# Altium schematic sheet HD3SS460-PORT 1.SchDoc
size A3; SheetNumber: 2; SheetTotal: 9
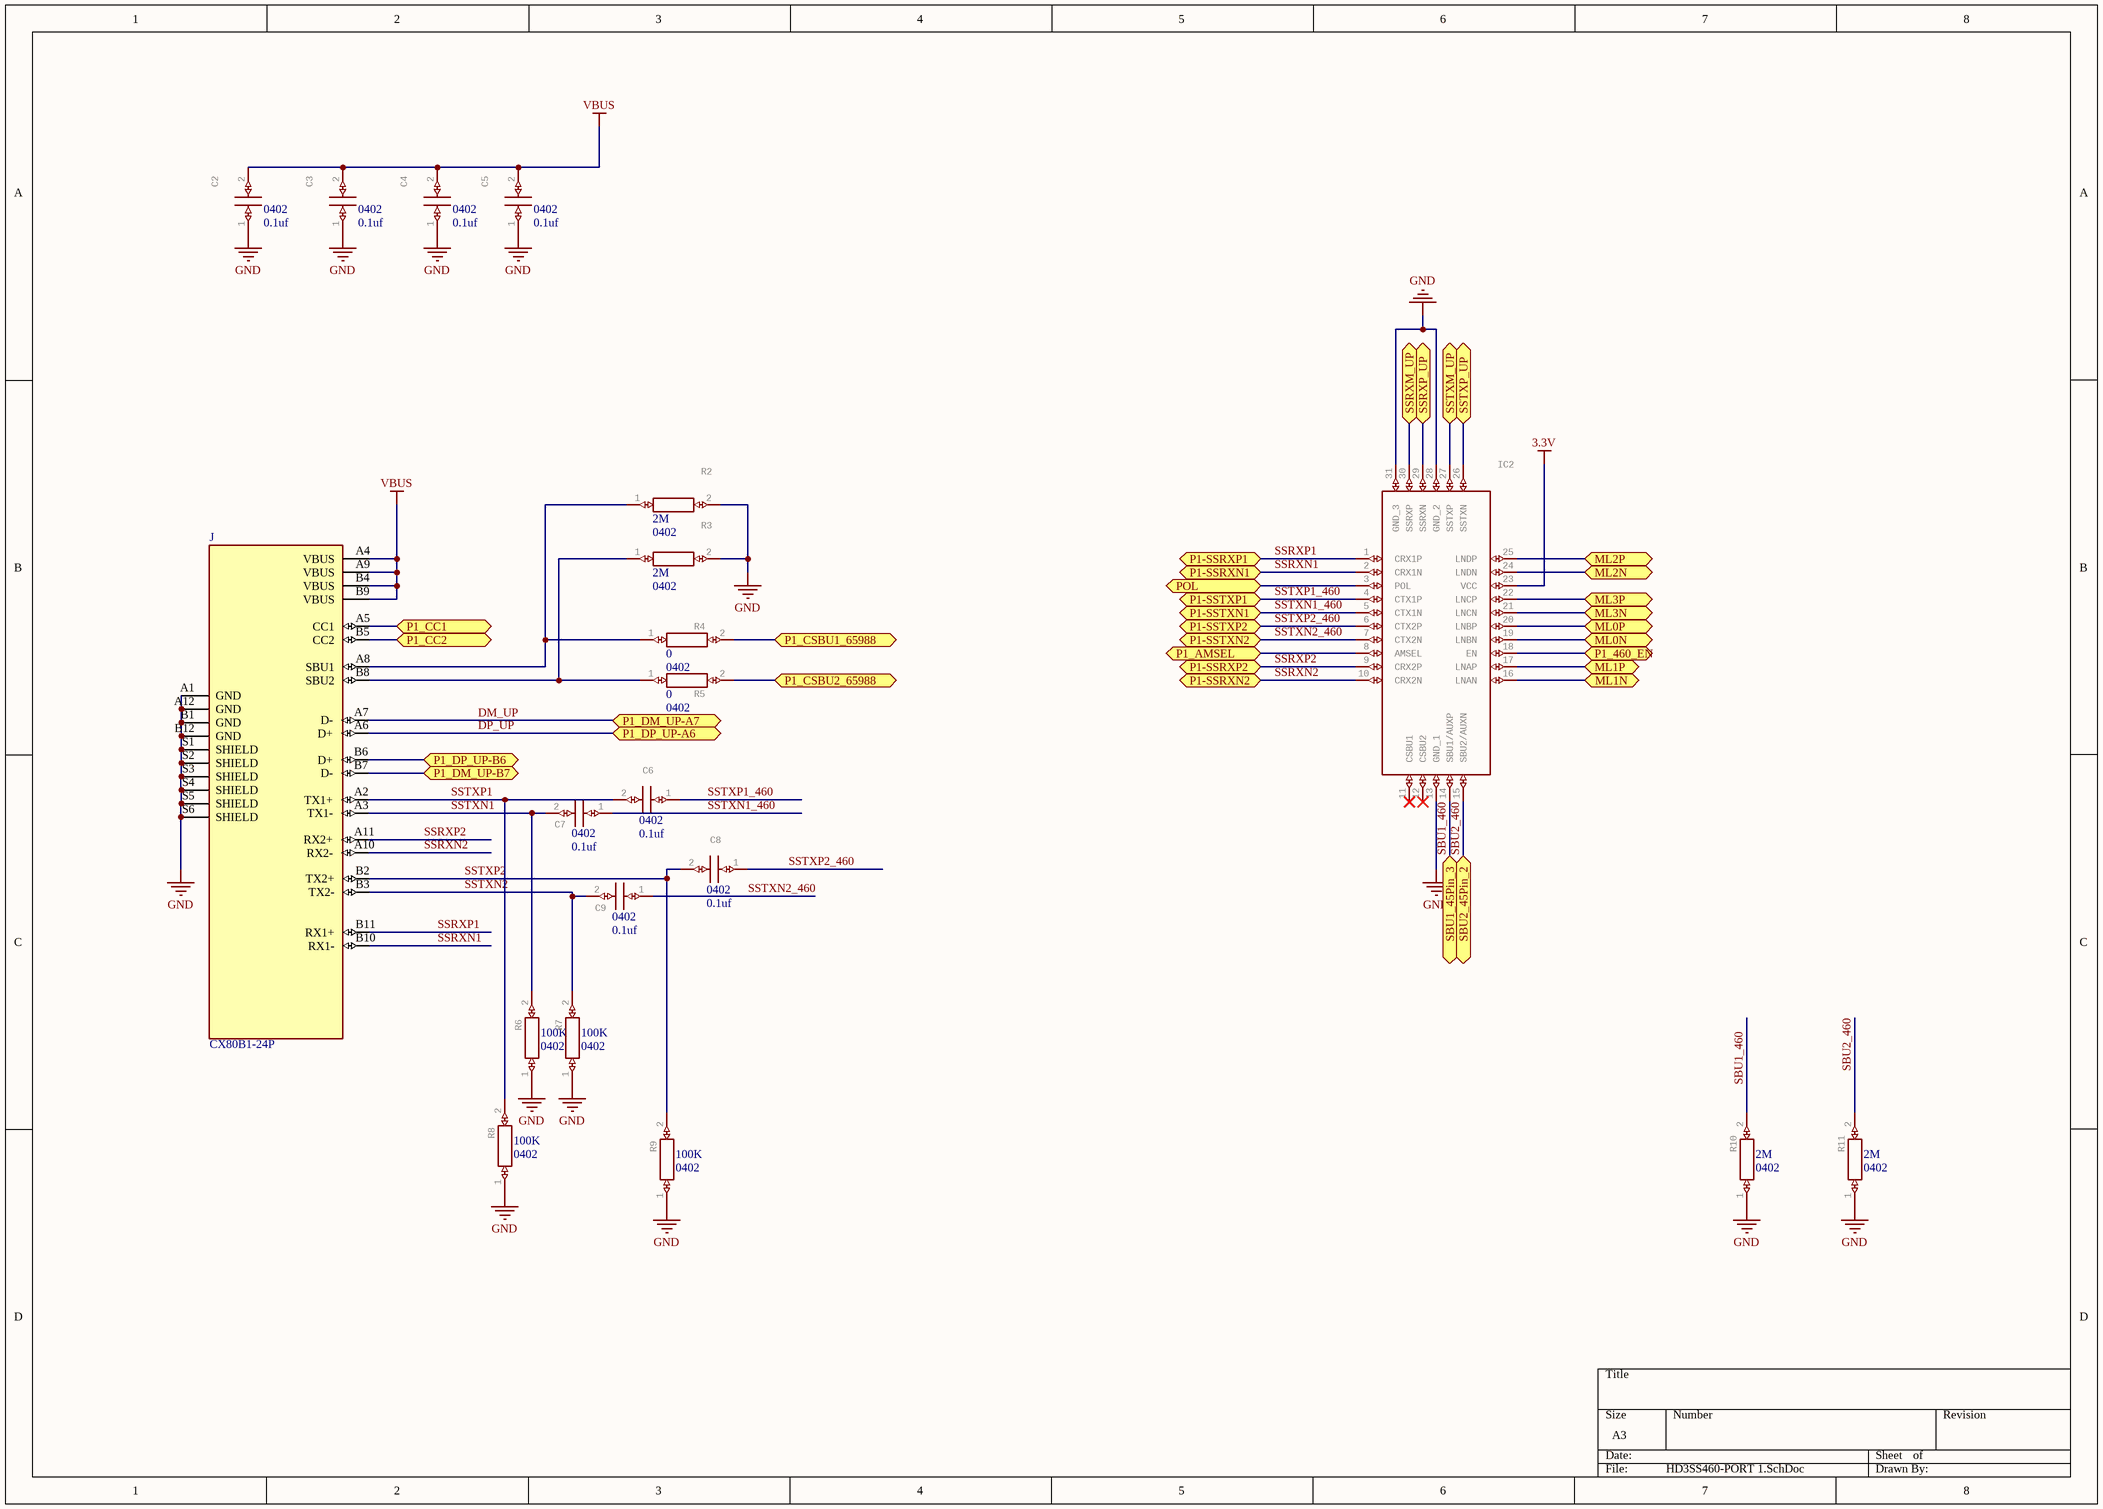
[diagram p0: HD3SS460-PORT 1.SchDoc]

## Parts
C2  value 0.1uf  Package: 0402  [CAPC1005X56N]  (hidden comment: Multilayer Ceramic Capacitors MLCC - SMD/SMT 50V .1uF X7R 0402 10% Tol   Source:  Datasheet)
C3  value 0.1uf  Package: 0402  [CAPC1005X56N]  (hidden comment: Multilayer Ceramic Capacitors MLCC - SMD/SMT 50V .1uF X7R 0402 10% Tol   Source:  Datasheet)
C4  value 0.1uf  Package: 0402  [CAPC1005X56N]  (hidden comment: Multilayer Ceramic Capacitors MLCC - SMD/SMT 50V .1uF X7R 0402 10% Tol   Source:  Datasheet)
C5  value 0.1uf  Package: 0402  [CAPC1005X56N]  (hidden comment: Multilayer Ceramic Capacitors MLCC - SMD/SMT 50V .1uF X7R 0402 10% Tol   Source:  Datasheet)
C6  value 0.1uf  Package: 0402  [CAPC1005X56N]  (hidden comment: Multilayer Ceramic Capacitors MLCC - SMD/SMT 50V .1uF X7R 0402 10% Tol   Source:  Datasheet)
C7  value 0.1uf  Package: 0402  [CAPC1005X56N]  (hidden comment: Multilayer Ceramic Capacitors MLCC - SMD/SMT 50V .1uF X7R 0402 10% Tol   Source:  Datasheet)
C8  value 0.1uf  Package: 0402  [CAPC1005X56N]  (hidden comment: Multilayer Ceramic Capacitors MLCC - SMD/SMT 50V .1uF X7R 0402 10% Tol   Source:  Datasheet)
C9  value 0.1uf  Package: 0402  [CAPC1005X56N]  (hidden comment: Multilayer Ceramic Capacitors MLCC - SMD/SMT 50V .1uF X7R 0402 10% Tol   Source:  Datasheet)
IC2  USB Type-C Alternate Mode 4x6 Differential Switch   Source:  Datasheet  [QFN40P250X450X80-31N]  (value not drawn)
J  CX80B1-24P  [HIROSE_CX80B1-24P]
R2  value 2M  Package: 0402  [RESC1005X40N]  (hidden comment: GENERAL PURPOSE CHIP RESISTORS   Source:  Datasheet)
R3  value 2M  Package: 0402  [RESC1005X40N]  (hidden comment: GENERAL PURPOSE CHIP RESISTORS   Source:  Datasheet)
R4  value 0  Package: 0402  [RESC1005X40N]  (hidden comment: GENERAL PURPOSE CHIP RESISTORS   Source:  Datasheet)
R5  value 0  Package: 0402  [RESC1005X40N]  (hidden comment: GENERAL PURPOSE CHIP RESISTORS   Source:  Datasheet)
R6  value 100K  Package: 0402  [RESC1005X40N]  (hidden comment: GENERAL PURPOSE CHIP RESISTORS   Source:  Datasheet)
R7  value 100K  Package: 0402  [RESC1005X40N]  (hidden comment: GENERAL PURPOSE CHIP RESISTORS   Source:  Datasheet)
R8  value 100K  Package: 0402  [RESC1005X40N]  (hidden comment: GENERAL PURPOSE CHIP RESISTORS   Source:  Datasheet)
R9  value 100K  Package: 0402  [RESC1005X40N]  (hidden comment: GENERAL PURPOSE CHIP RESISTORS   Source:  Datasheet)
R10  value 2M  Package: 0402  [RESC1005X40N]  (hidden comment: GENERAL PURPOSE CHIP RESISTORS   Source:  Datasheet)
R11  value 2M  Package: 0402  [RESC1005X40N]  (hidden comment: GENERAL PURPOSE CHIP RESISTORS   Source:  Datasheet)

## Ports
ML0N (bidir), ML0P (bidir), ML1N (bidir), ML1P (bidir), ML2N (bidir), ML2P (bidir), ML3N (bidir), ML3P (bidir), P1-SSRXN1 (bidir), P1-SSRXN2 (bidir), P1-SSRXP1 (bidir), P1-SSRXP2 (bidir), P1-SSTXN1 (bidir), P1-SSTXN2 (bidir), P1-SSTXP1 (bidir), P1-SSTXP2 (bidir), P1_460_EN (bidir), P1_AMSEL (bidir), P1_CC1 (bidir), P1_CC2 (bidir), P1_CSBU1_65988 (bidir), P1_CSBU2_65988 (bidir), P1_DM_UP-A7 (bidir), P1_DM_UP-B7 (bidir), P1_DP_UP-A6 (bidir), P1_DP_UP-B6 (bidir), POL (bidir), SBU1_45Pin_3 (bidir), SBU2_45Pin_2 (bidir), SSRXM_UP (bidir), SSRXP_UP (bidir), SSTXM_UP (bidir), SSTXP_UP (bidir)

## Nets
3.3V: IC2.23(VCC)
GND: C2.1 C3.1 C4.1 C5.1 IC2.13(GND_1) IC2.28(GND_2) IC2.31(GND_3) J.A1(GND) J.A12(GND) J.B1(GND) J.B12(GND) J.S1(SHIELD) J.S2(SHIELD) J.S3(SHIELD) J.S4(SHIELD) J.S5(SHIELD) J.S6(SHIELD) R2.2 R3.2 R6.1 R7.1 R8.1 R9.1 R10.1 R11.1
VBUS: C2.2 C3.2 C4.2 C5.2 J.A4(VBUS) J.A9(VBUS) J.B4(VBUS) J.B9(VBUS)
DP_UP: J.A6(D+) ; port P1_DP_UP-A6
ML0N: IC2.19(LNBN) ; port ML0N
ML0P: IC2.20(LNBP) ; port ML0P
ML1N: IC2.16(LNAN) ; port ML1N
ML1P: IC2.17(LNAP) ; port ML1P
ML2N: IC2.24(LNDN) ; port ML2N
ML2P: IC2.25(LNDP) ; port ML2P
ML3N: IC2.21(LNCN) ; port ML3N
ML3P: IC2.22(LNCP) ; port ML3P
P1_460_EN: IC2.18(EN) ; port P1_460_EN
P1_AMSEL: IC2.8(AMSEL) ; port P1_AMSEL
P1_CC1: J.A5(CC1) ; port P1_CC1
P1_CC2: J.B5(CC2) ; port P1_CC2
P1_CSBU1_65988: R4.2 ; port P1_CSBU1_65988
P1_CSBU2_65988: R5.2 ; port P1_CSBU2_65988
P1_DM_UP-B7: J.B7(D-) ; port P1_DM_UP-B7
P1_DP_UP-B6: J.B6(D+) ; port P1_DP_UP-B6
POL: IC2.3(POL) ; port POL
SBU1_460: IC2.14(SBU1/AUXP) R10.2 ; port SBU1_45Pin_3
SBU2_460: IC2.15(SBU2/AUXN) R11.2 ; port SBU2_45Pin_2
SSRXM_UP: IC2.30(SSRXP) ; port SSRXM_UP
SSRXN1: IC2.2(CRX1N) J.B10(RX1-) ; port P1-SSRXN1
SSRXN2: IC2.10(CRX2N) J.A10(RX2-) ; port P1-SSRXN2
SSRXP1: IC2.1(CRX1P) J.B11(RX1+) ; port P1-SSRXP1
SSRXP2: IC2.9(CRX2P) J.A11(RX2+) ; port P1-SSRXP2
SSRXP_UP: IC2.29(SSRXN) ; port SSRXP_UP
SSTXM_UP: IC2.27(SSTXP) ; port SSTXM_UP
SSTXN1: C7.2 J.A3(TX1-) R6.2
SSTXN1_460: C7.1 IC2.5(CTX1N) ; port P1-SSTXN1
SSTXN2: C9.2 J.B3(TX2-) R7.2
SSTXN2_460: C9.1 IC2.7(CTX2N) ; port P1-SSTXN2
SSTXP1: C6.2 J.A2(TX1+) R8.2
SSTXP1_460: C6.1 IC2.4(CTX1P) ; port P1-SSTXP1
SSTXP2: C8.2 J.B2(TX2+) R9.2
SSTXP2_460: C8.1 IC2.6(CTX2P) ; port P1-SSTXP2
SSTXP_UP: IC2.26(SSTXN) ; port SSTXP_UP
NetJ_A8: J.A8(SBU1) R2.1 R4.1
NetJ_B8: J.B8(SBU2) R3.1 R5.1

Not connected (* = marked no-connect by the designer): IC2 11(CSBU1)* 12(CSBU2)*; J A7(D-)

## Notes on the sheet
- Labels drawn without touching a wire or pin: DM_UP

## Library data of the parts
C2-C9 = 04025C104KAT2A: Manufacturer_Name: AVX; GateName_1: G$1; SymbolName_1: 04025C104KAT2A; LibraryName: 04025C104KAT2A; DeviceSetName: 04025C104KAT2A; Manufacturer_Part_Number: 04025C104KAT2A; Mouser_Part_Number: 581-04025C104KAT2A; Mouser_Price-Stock: https://www.mouser.co.uk/ProductDetail/AVX/04025C104KAT2A?qs=ZBeOGGPQgEFYcwOskjAIVQ%3D%3D; Arrow_Part_Number: 04025C104KAT2A; Arrow_Price-Stock: https://www.arrow.com/en/products/04025c104kat2a/avx?region=nac; Height: 0.56mm
IC2 = HD3SS460RNHR: Manufacturer_Name: Texas Instruments; GateName_1: G$1; SymbolName_1: HD3SS460RNHR; LibraryName: HD3SS460RNHR; DeviceSetName: HD3SS460RNHR; Package: QFN40P250X450X80-31N; Manufacturer_Part_Number: HD3SS460RNHR; Mouser_Part_Number: 595-HD3SS460RNHR; Mouser_Price-Stock: https://www.mouser.co.uk/ProductDetail/Texas-Instruments/HD3SS460RNHR?qs=6BVwEky2YVwfkjqmIesFTw%3D%3D; Arrow_Part_Number: HD3SS460RNHR; Arrow_Price-Stock: https://www.arrow.com/en/products/hd3ss460rnhr/texas-instruments; Height: 0.8mm
J = CX80B1-24P: USB-C _USB TYPE-C_ USB 3.1 _USB 3.1 Gen 2, Superspeed+_ Receptacle Connector 24 Position Surface Mount, Through Hole; MF: Hirose Electric Co Ltd; SnapEDA_Link: https://www.snapeda.com/parts/CX80B1-24P/Hirose%20Electric%20Co%20Ltd/view-part/3218887/?ref=snap; MP: CX80B1-24P; Package: None; Digi-Key_Part_Number: 26-CX80B1-24PCT-ND; Value: *; Digi-Key_Purchase_URL: https://www.digikey.com/product-detail/en/hirose-electric-co-ltd/CX80B1-24P/26-CX80B1-24PCT-ND/9816162?utm_source=snapeda&utm_medium=aggregator&utm_campaign=symbol
R2-R11 = RC0402FR-071KL: Manufacturer_Name: KEMET; GateName_1: G$1; SymbolName_1: RC0402FR-071KL; LibraryName: RC0402FR-071KL; DeviceSetName: RC0402FR-071KL; Manufacturer_Part_Number: RC0402FR-071KL; Mouser_Part_Number: 603-RC0402FR-071KL; Mouser_Price-Stock: https://www.mouser.co.uk/ProductDetail/YAGEO/RC0402FR-071KL?qs=V1yeUXFNrknDEmWLmm5v6g%3D%3D; Arrow_Part_Number: RC0402FR-071KL; Arrow_Price-Stock: https://www.arrow.com/en/products/rc0402fr-071kl/yageo?region=nac; Height: 0.4mm